# Altium schematic sheet Pg05_ Platform_Power.SchDoc: PLATFORM POWER
size A2; DrawnBy: RvS; DocumentNumber: 5; SheetNumber: 5; SheetTotal: 16
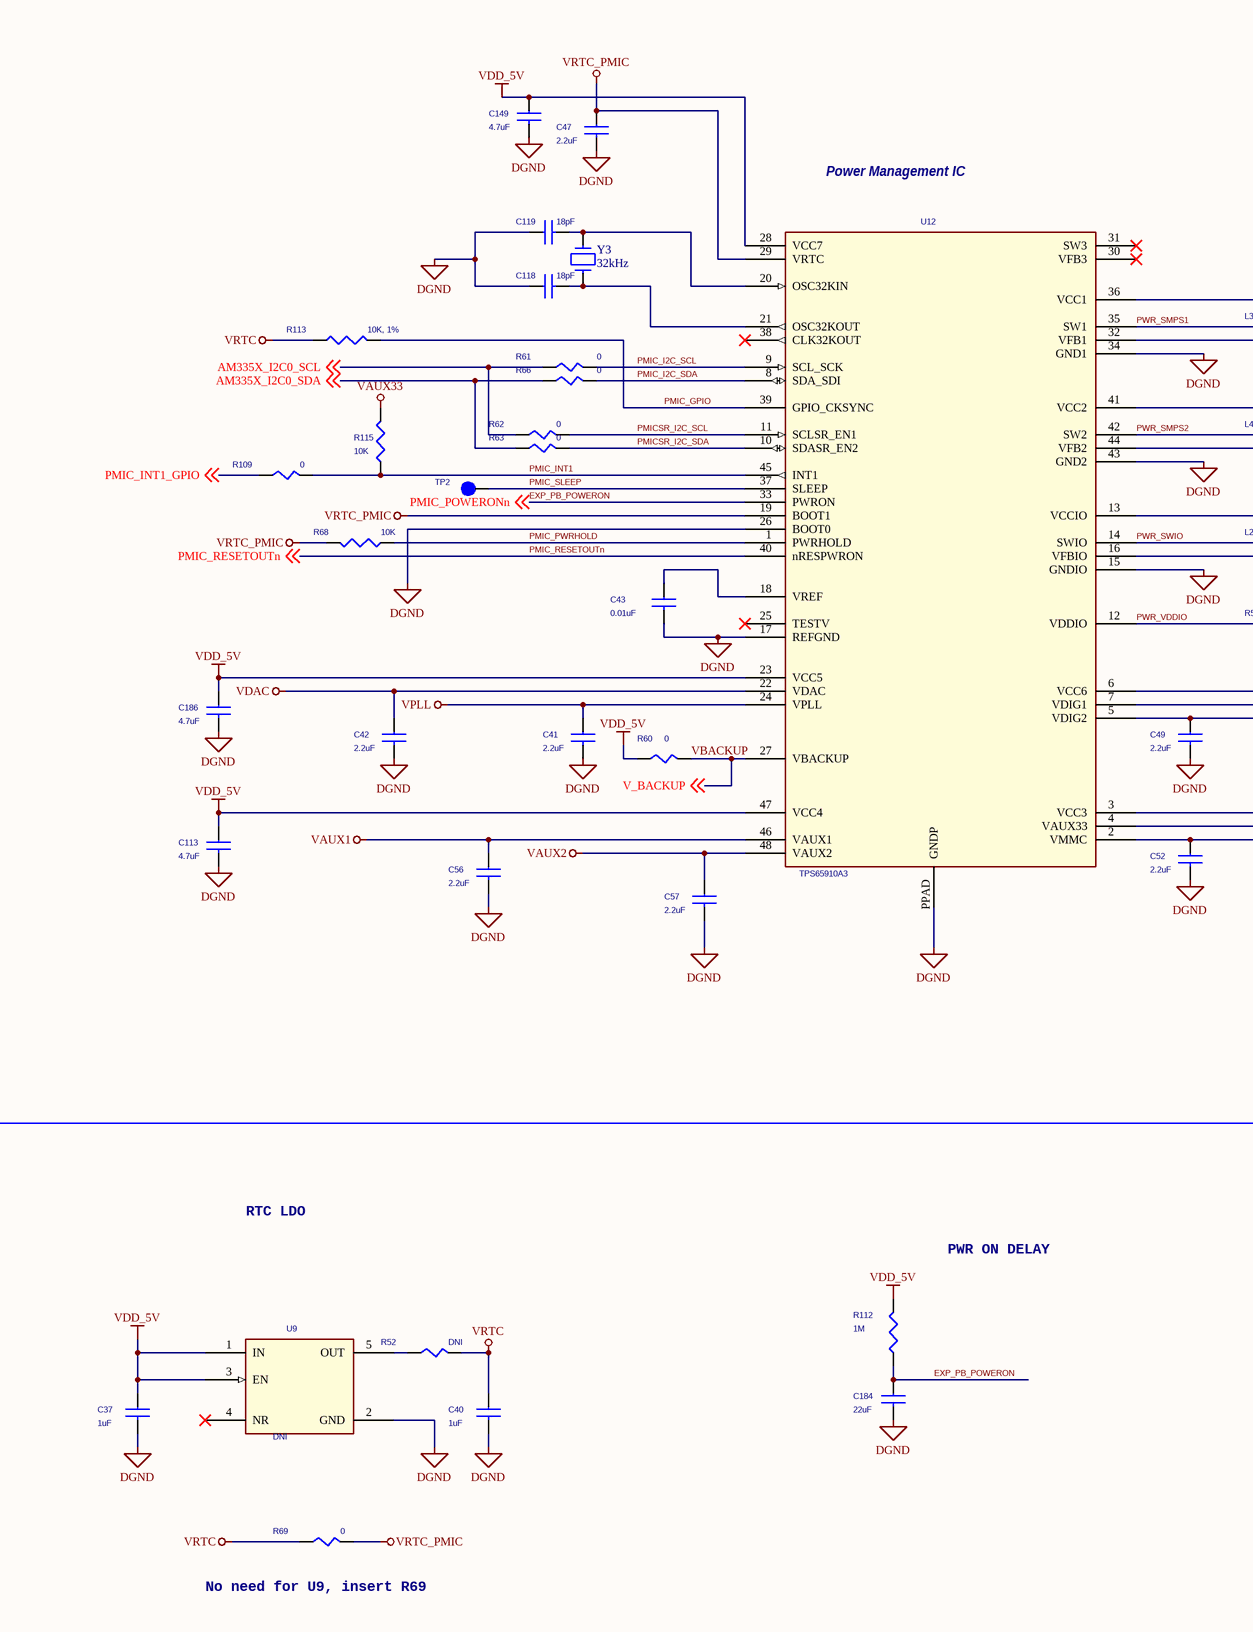
[diagram p0: Pg05_ Platform_Power.SchDoc, left]
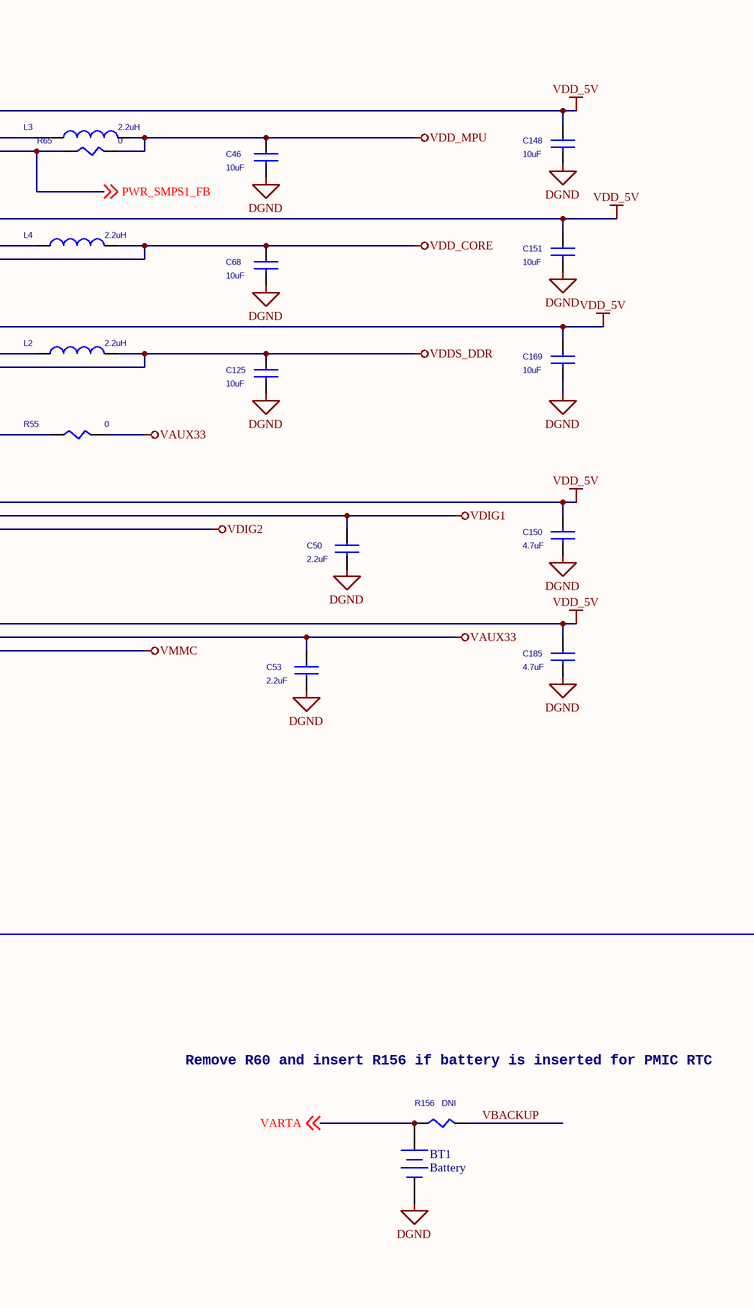
[diagram p1: Pg05_ Platform_Power.SchDoc, right]

## Parts
?  (no value)  (graphical)
BT1  Battery  [BAT_Varta12mm]
C37  1uF  [SM-7351-CAP-0402]
C40  1uF  [SM-7351-CAP-0402]
C41  2.2uF  [SM-7351-CAP-0402]
C42  2.2uF  [SM-7351-CAP-0402]
C43  0.01uF  [SM-7351-CAP-0402]
C46  10uF  [SM-7351-CAP-0805]
C47  2.2uF  [SM-7351-CAP-0402]
C49  2.2uF  [SM-7351-CAP-0402]
C50  2.2uF  [SM-7351-CAP-0402]
C52  2.2uF  [SM-7351-CAP-0402]
C53  2.2uF  [SM-7351-CAP-0402]
C56  2.2uF  [SM-7351-CAP-0402]
C57  2.2uF  [SM-7351-CAP-0402]
C68  10uF  [SM-7351-CAP-0805]
C113  4.7uF  [SM-7351-CAP-0603]
C118  18pF  [SM-7351-CAP-0402]
C119  18pF  [SM-7351-CAP-0402]
C125  10uF  [SM-7351-CAP-0805]
C148  10uF  [SM-7351-CAP-0805]
C149  4.7uF  [SM-7351-CAP-0603]
C150  4.7uF  [SM-7351-CAP-0603]
C151  10uF  [SM-7351-CAP-0805]
C169  10uF  [SM-7351-CAP-0805]
C184  22uF  [1206]
C185  4.7uF  [SM-7351-CAP-0603]
C186  4.7uF  [SM-7351-CAP-0603]
L2  2.2uH  [VLCF5020T]
L3  2.2uH  [VLCF5020T]
L4  2.2uH  [VLCF5020T]
R52  DNI  [SM-7351-RES-0603]
R55  0  [SM-7351-RES-0603]
R60  0  [SM-7351-RES-0402]
R61  0  [SM-7351-RES-0402]
R62  0  [SM-7351-RES-0402]
R63  0  [SM-7351-RES-0402]
R65  0  [SM-7351-RES-0402]
R66  0  [SM-7351-RES-0402]
R68  10K  [SM-7351-RES-0402]
R69  0  [SM-7351-RES-0603]
R109  0  [SM-7351-RES-0402]
R112  1M  [SM-7351-RES-0402]
R113  10K, 1%  [SM-7351-RES-0402]
R115  10K  [SM-7351-RES-0402]
R156  DNI  [SM-7351-RES-0402]
TP2  TP1mm  [tp_smd1mmcircle]  (value not drawn)
U9  DNI  [smdsc70-5]
U12  TPS65910A3  [U_48_RSL]
Y3  32kHz  [Xtal 3215]

## Nets
DGND: BT1.2(-) C37.2 C40.2 C41.2 C42.2 C43.2 C46.2 C47.2 C49.2 C50.2 C52.2 C53.2 C56.2 C57.2 C68.2 C113.2 C118.1 C119.1 C125.2 C148.2 C149.2 C150.2 C151.2 C169.2 C184.2 C185.2 C186.2 U9.2(GND) U12.15(GNDIO) U12.17(REFGND) U12.26(BOOT0) U12.34(GND1) U12.43(GND2) U12.PPAD(GNDP)
VAUX1: C56.1 U12.46(VAUX1)
VAUX2: C57.1 U12.48(VAUX2)
VAUX33: C53.1 R55.1(P1) R115.2(P2) U12.4(VAUX33)
VDAC: C42.1 U12.22(VDAC)
VDD_5V: C37.1 C113.1 C148.1 C149.1 C150.1 C151.1 C169.1 C185.1 C186.1 R60.2(P2) R112.2(P2) U9.1(IN) U9.3(EN) U12.3(VCC3) U12.6(VCC6) U12.13(VCCIO) U12.23(VCC5) U12.28(VCC7) U12.36(VCC1) U12.41(VCC2) U12.47(VCC4)
VDD_CORE: C68.1 L4.2 U12.44(VFB2)
VDD_MPU: C46.1 L3.2 R65.1(P1)
VDDS_DDR: C125.1 L2.2 U12.16(VFBIO)
VDIG1: C50.1 U12.7(VDIG1)
VDIG2: C49.1 U12.5(VDIG2)
VMMC: C52.1 U12.2(VMMC)
VPLL: C41.1 U12.24(VPLL)
VRTC: C40.1 R52.1(P1) R69.2(P2) R113.1
VRTC_PMIC: C47.1 R68.2(P2) R69.1(P1) U12.19(BOOT1) U12.29(VRTC)
AM335X_I2C0_SCL: R61.2(P2) R62.2(P2) ; off-sheet AM335X_I2C0_SCL
AM335X_I2C0_SDA: R63.2(P2) R66.2(P2) ; off-sheet AM335X_I2C0_SDA
EXP_PB_POWERON: C184.1 R112.1(P1) U12.33(PWRON) ; off-sheet PMIC_POWERONn  [also labelled PMIC_POWERONn]
PMIC_GPIO: R113.2 U12.39(GPIO_CKSYNC)
PMIC_I2C_SCL: R61.1(P1) U12.9(SCL_SCK)
PMIC_I2C_SDA: R66.1(P1) U12.8(SDA_SDI)
PMIC_INT1: R109.1(P1) R115.1(P1) U12.45(INT1)
PMIC_INT1_GPIO: R109.2(P2) ; off-sheet PMIC_INT1_GPIO
PMIC_PWRHOLD: R68.1(P1) U12.1(PWRHOLD)
PMIC_RESETOUTn: U12.40(nRESPWRON) ; off-sheet PMIC_RESETOUTn
PMIC_SLEEP: TP2.1 U12.37(SLEEP)
PMICSR_I2C_SCL: R62.1(P1) U12.11(SCLSR_EN1)
PMICSR_I2C_SDA: R63.1(P1) U12.10(SDASR_EN2)
PWR_SMPS1: L3.1 U12.35(SW1)
PWR_SMPS1_FB: R65.2(P2) U12.32(VFB1) ; off-sheet PWR_SMPS1_FB
PWR_SMPS2: L4.1 U12.42(SW2)
PWR_SWIO: L2.1 U12.14(SWIO)
PWR_VDDIO: R55.2(P2) U12.12(VDDIO)
VARTA: BT1.1(+) R156.2(P2) ; off-sheet VARTA
VBACKUP: R60.1(P1) R156.1(P1) U12.27(VBACKUP) ; off-sheet V_BACKUP  [also labelled V_BACKUP]
NetC43_1: C43.1 U12.18(VREF)
NetC118_2: C118.2 U12.21(OSC32KOUT) Y3.1
NetC119_2: C119.2 U12.20(OSC32KIN) Y3.2
NetR52_2: R52.2(P2) U9.5(OUT)

Not connected (* = marked no-connect by the designer): U9 4(NR)*; U12 25(TESTV)* 30(VFB3)* 31(SW3)* 38(CLK32KOUT)*

## Notes on the sheet
- Power Management IC
- RTC LDO
- PWR ON DELAY
- Remove R60 and insert R156 if battery is inserted for PMIC RTC
- (near R69) No need for U9, insert R69
- Embedded Vision Systems Group
- Title
- School of Electrical and Electronic Engineering
- Date:
- Size
- Document Number
- Sheet
- of
- Rev

## Library data of the parts
? = Title Block Address(1): UoM title block
BT1 = Battery: Multicell Battery; Published: 24-Mar-1999; LatestRevisionDate: 17-Jul-2002; LatestRevisionNote: Re-released for DXP Platform.; PackageReference: BAT-2; Publisher: Altium Limited
C37 C40 = 1uFCapacitor10V10%0402: TIIntPartnumber: 1C0084; MfrNum: 0402ZD105KAT2A; Mfr: AVX; PartName: 1uF10V10%0402; DescriptiveText: Capacitor 1uF 10V Ceramic 10% 0402; Cost10K: 0.201; Cost100: 0.336; Vendor: Digikey
C41 C42 C47 C49 C50 C52 C53 C56 C57 = 2.2uFCapacitor6.3V20%smdX5R0402: Capacitor 2.2uF Ceramic, 6.3V, X5R, 20%; TIIntPartnumber: 1C0091; MfrNum: JMK105BJ225MV-F; Mfr: Taiyo Yuden; PartName: 2.2uF6.3V20%smdX5R; Cost10K: 0.0516; Cost100: 0.50; Vendor: Digikey; TN: 207-0054-000; PN: 0402YC103KAT2A; DescriptiveText: Capacitor 2.2uF Ceramic, 6.3V, X5R, 20%; Descriptive_Text: Capacitor 2.2uF Ceramic, 6.3V, X5R, 20%
C43 = 0.01uFCapacitor16V10%0402_Dup1: Mfr: Panasonic; PartName: 0.01uF16V10%SMD0402; MfrNum: ECJ-0YB1C103K; TIIntPartnumber: 1C0012; PN: 0402YC103KAT2A; TN: 207-0054-000; Vendor: Digikey; Cost100: 0.00; Cost10K: 0.015; DescriptiveText: Capacitor 0.01uF 16V 10% 0402
C46 C68 C125 C148 C151 C169 C184 = 10uFCapacitor16V10%0805: Capacitor 10uF 16V 10% Ceramic 0805; PartName: 10uF16V10%SMD0805; Mfr: AVX; MfrNum: 0805YD106KAT2A; TIIntPartnumber: 1C0085; Vendor: Digikey; Cost100: 0.19; Cost10K: 0.042; Descriptive_Text: Capacitor 10uF 16V 10% Ceramic 0805; DescriptiveText: Capacitor 10uF 16V 10% Ceramic 0805
C113 C149 C150 C185 C186 = 4.7uFCapacitor16V10%0603: TIIntPartnumber: 1C0103; MfrNum: EMK107ABJ475KA-T; Mfr: Taiyo Yuden; PartName: 4.7uF16V10%SMD0603; Cost10K: 0.00590; Cost100: 0.0198; Vendor: Digikey; DescriptiveText: Capacitor Ceramic 4.7uF 16V 10% 0603
C118 C119 = 22pFCapacitor50V10%SMD0402: Capacitor 22pF 50V 10% 0402; PartName: 22pF50V10%SMD0402; Mfr: Panasonic; MfrNum: ECJ-0EC1H220J; TIIntPartnumber: 1C0020; Vendor: Digikey; Cost100: 0.1678; DescriptiveText: Capacitor 22pF 50V 10% 0402; Cost10K: 0.1678; Descriptive_Text: Capacitor 22pF 50V 10% 0402
L2 L4 = 2.2uHInductor10%2_1.6Asmd: PartName: 2.2uH10%2.6Asmd; Mfr: TDK; MfrNum: VLCF5020T-2R2N2R6-3; TIIntPartnumber: 1L0025; DescriptiveText: Inductor 2.2uH smt 2.6A, 58 milliohm; Vendor: Digikey; Cost100: 1.11; Cost10K: 0.3501
L3 = 2.2uHInductor10%2_0.6Asmd: PartName: 2.2uH10%2.6Asmd; Mfr: TDK; MfrNum: VLCF5020T-2R2N2R6-3; TIIntPartnumber: 1L0025; DescriptiveText: Inductor 2.2uH smt 2.6A, 58 milliohm; Vendor: Digikey; Cost100: 1.11; Cost10K: 0.3501
R52 R69 = ZeroOhmResistor1/16W0603: Resistor Zero ohm Jumper 0603; TIIntPartnumber: 1R0096; MfrNum: ERJ-3GEY0R00V; Mfr: Panasonic; PartName: ZeroohmSMD0603; Cost10K: 0.058; Cost100: 0.08; Vendor: DIGIKEY; Descriptive_Text: Resistor Zero ohm Jumper 0603; DescriptiveText: Resistor Zero ohm Jumper 0603
R55 = ZeroOhmResistor1/16W0603_Dup1: Resistor Zero ohm Jumper 0603; PartName: ZeroohmSMD0603; Mfr: Panasonic; MfrNum: ERJ-3GEY0R00V; TIIntPartnumber: 1R0096; Vendor: Digikey; Cost100: 0.08; Cost10K: 0.058; DescriptiveText: Resistor Zero ohm Jumper 0603; Descriptive_Text: Resistor Zero ohm Jumper 0603
R60-R63 R65 R66 R156 = ZeroOhmResistor1/16W0402_Dup4: Resistor Zero ohm Jumper 0402; TIIntPartnumber: 1R0098; MfrNum: ERJ-2GE0R00X; Mfr: Panasonic; PartName: ZeroohmSMD0402; Cost10K: 0.0020; Cost100: 0.08; Vendor: Digikey; Descriptive_Text: Resistor Zero ohm Jumper 0402; DescriptiveText: Resistor Zero ohm Jumper 0402
R68 R112 R115 = 10KOhmResistor1/16W0402_Dup1: Resistor 10Kohm 1/16W 5% 0402; TIIntPartnumber: 1R0168; MfrNum: MCR01MZPJ103; Mfr: Rohm; PartName: 10Kohm1/16W5%SMD0402; Cost10K: 0.0017; Cost100: 0.03; Vendor: Digikey; Descriptive_Text: Resistor 10Kohm 1/16W 5% 0402; DescriptiveText: Resistor 10Kohm 1/16W 5% 0402
R109 = ZeroOhmResistor1/16W0402_Dup2: Resistor Zero ohm Jumper 0402; PartName: ZeroohmSMD0402; Mfr: Panasonic; MfrNum: ERJ-2GE0R00X; TIIntPartnumber: 1R0098; Vendor: DIGIKEY; Cost100: 0.08; Cost10K: 0.0020; DescriptiveText: Resistor Zero ohm Jumper 0402; Descriptive_Text: Resistor Zero ohm Jumper 0402
R113 = 10KOhmResistor1/10W1%0402_Dup2: TIIntPartnumber: 1R0254; MfrNum: ERJ-2RKF1002X; Mfr: PANASONIC-ECG; PartName: 10Kohm1/10W1%smd0402; DescriptiveText: Resistor 10Kohm 1/10W 1% 0402; Cost10K: 0.00291; Cost100: 0.011; Vendor: DIGIKEY
TP2 = Testpoint_SMD1mmCircle: Testpoint SMD 1mm circle pad; TIIntPartnumber: 2H0046; Cost10K: 0.00; Cost100: 0; Descriptive_Text: Testpoint SMD 1mm circle pad; Vendor: N/A; MfrNum: N/A; Mfr: N/A; PartName: TestpointSMD1mmCircle; DescriptiveText: Testpoint SMD 1mm circle pad
U9 = TPS71718: Low Dropout 1.8V 150mA Linear Regulator; Mfr: TI; MfrNum: TPS71718DCK; TIIntPartnumber: 1A0262; Vendor: Digikey; Cost100: 1.21; Cost10K: 0.7560; DescriptiveText: Low Dropout 1.8V 150mA Linear Regulator; PartName: TPS71718; Descriptive_Text: Low Dropout 1.8V 150mA Linear Regulator
U12 = TPS65910A3: Mfr: TI; MfrNum: TPS65910A3A1RSL; TIIntPartnumber: 1A0303; DescriptiveText: Integrated Power Management Unit for DDR3; Vendor: Farnell; Cost100: 1.99; Cost10K: 1.11; Vendor Order No.: 2144288; PartName: TPS65910A3
Y3 = CRYSTAL